# Altium schematic sheet control_sonar_logic.SchDoc
size Letter
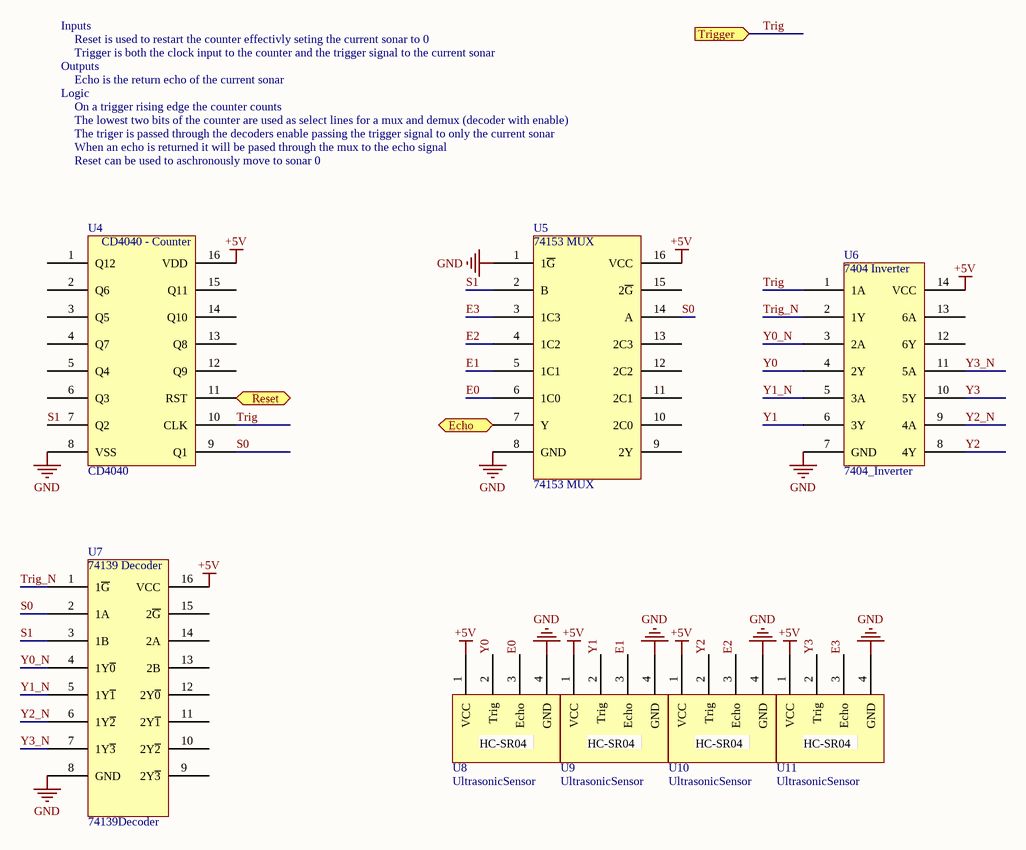
[diagram p0: control_sonar_logic.SchDoc]

## Parts
U4  CD4040  [DIP-16]
U5  74153 MUX  [DIP-16]
U6  7404_Inverter  [DIP-14]
U7  74139Decoder  [DIP-16]
U8  UltrasonicSensor  [HDR1X4]
U9  UltrasonicSensor  [HDR1X4]
U10  UltrasonicSensor  [HDR1X4]
U11  UltrasonicSensor  [HDR1X4]

## Ports
Echo (out), Reset (in), Trigger (in)

## Nets
+5V: U4.16(VDD) U5.16(VCC) U6.14(VCC) U7.16(VCC) U8.1(VCC) U9.1(VCC) U10.1(VCC) U11.1(VCC)
GND: U4.8(VSS) U5.1(1~{G}) U5.8(GND) U6.7(GND) U7.8(GND) U8.4(GND) U9.4(GND) U10.4(GND) U11.4(GND)
E0: U5.6(1C0) U8.3(Echo)
E1: U5.5(1C1) U9.3(Echo)
E2: U5.4(1C2) U10.3(Echo)
E3: U5.3(1C3) U11.3(Echo)
Echo: U5.7(Y) ; port Echo
Reset: U4.11(RST) ; port Reset
S0: U4.9(Q1) U5.14(A) U7.2(1A)
S1: U4.7(Q2) U5.2(B) U7.3(1B)
Trig: U4.10(CLK) U6.1(1A) ; port Trigger
Trig_N: U6.2(1Y) U7.1(1~{G})
Y0: U6.4(2Y) U8.2(Trig)
Y0_N: U6.3(2A) U7.4(1Y~{0})
Y1: U6.6(3Y) U9.2(Trig)
Y1_N: U6.5(3A) U7.5(1Y~{1})
Y2: U6.8(4Y) U10.2(Trig)
Y2_N: U6.9(4A) U7.6(1Y~{2})
Y3: U6.10(5Y) U11.2(Trig)
Y3_N: U6.11(5A) U7.7(1Y~{3})

Not connected (* = marked no-connect by the designer): U4 1(Q12) 2(Q6) 3(Q5) 4(Q7) 5(Q4) 6(Q3) 12(Q9) 13(Q8) 14(Q10) 15(Q11); U5 9(2Y) 10(2C0) 11(2C1) 12(2C2) 13(2C3) 15(2~{G}); U6 12(6Y) 13(6A); U7 9(2Y~{3}) 10(2Y~{2}) 11(2Y~{1}) 12(2Y~{0}) 13(2B) 14(2A) 15(2~{G})

## Notes on the sheet
- Inputs
- Trigger is both the clock input to the counter and the trigger signal to the current sonar
- Reset is used to restart the counter effectivly seting the current sonar to 0
- Outputs
- Logic
- Echo is the return echo of the current sonar
- On a trigger rising edge the counter counts
- The lowest two bits of the counter are used as select lines for a mux and demux (decoder with enable)
- The triger is passed through the decoders enable passing the trigger signal to only the current sonar
- When an echo is returned it will be pased through the mux to the echo signal
- Reset can be used to aschronously move to sonar 0
- (in symbol 7404_Inverter) 7404 Inverter
- (in symbol 74139Decoder) 74139 Decoder
- (in symbol CD4040) CD4040 - Counter
- (in symbol UltrasonicSensor) HC-SR04